# EAGLE design TU56 (EAGLE 6.6.0)
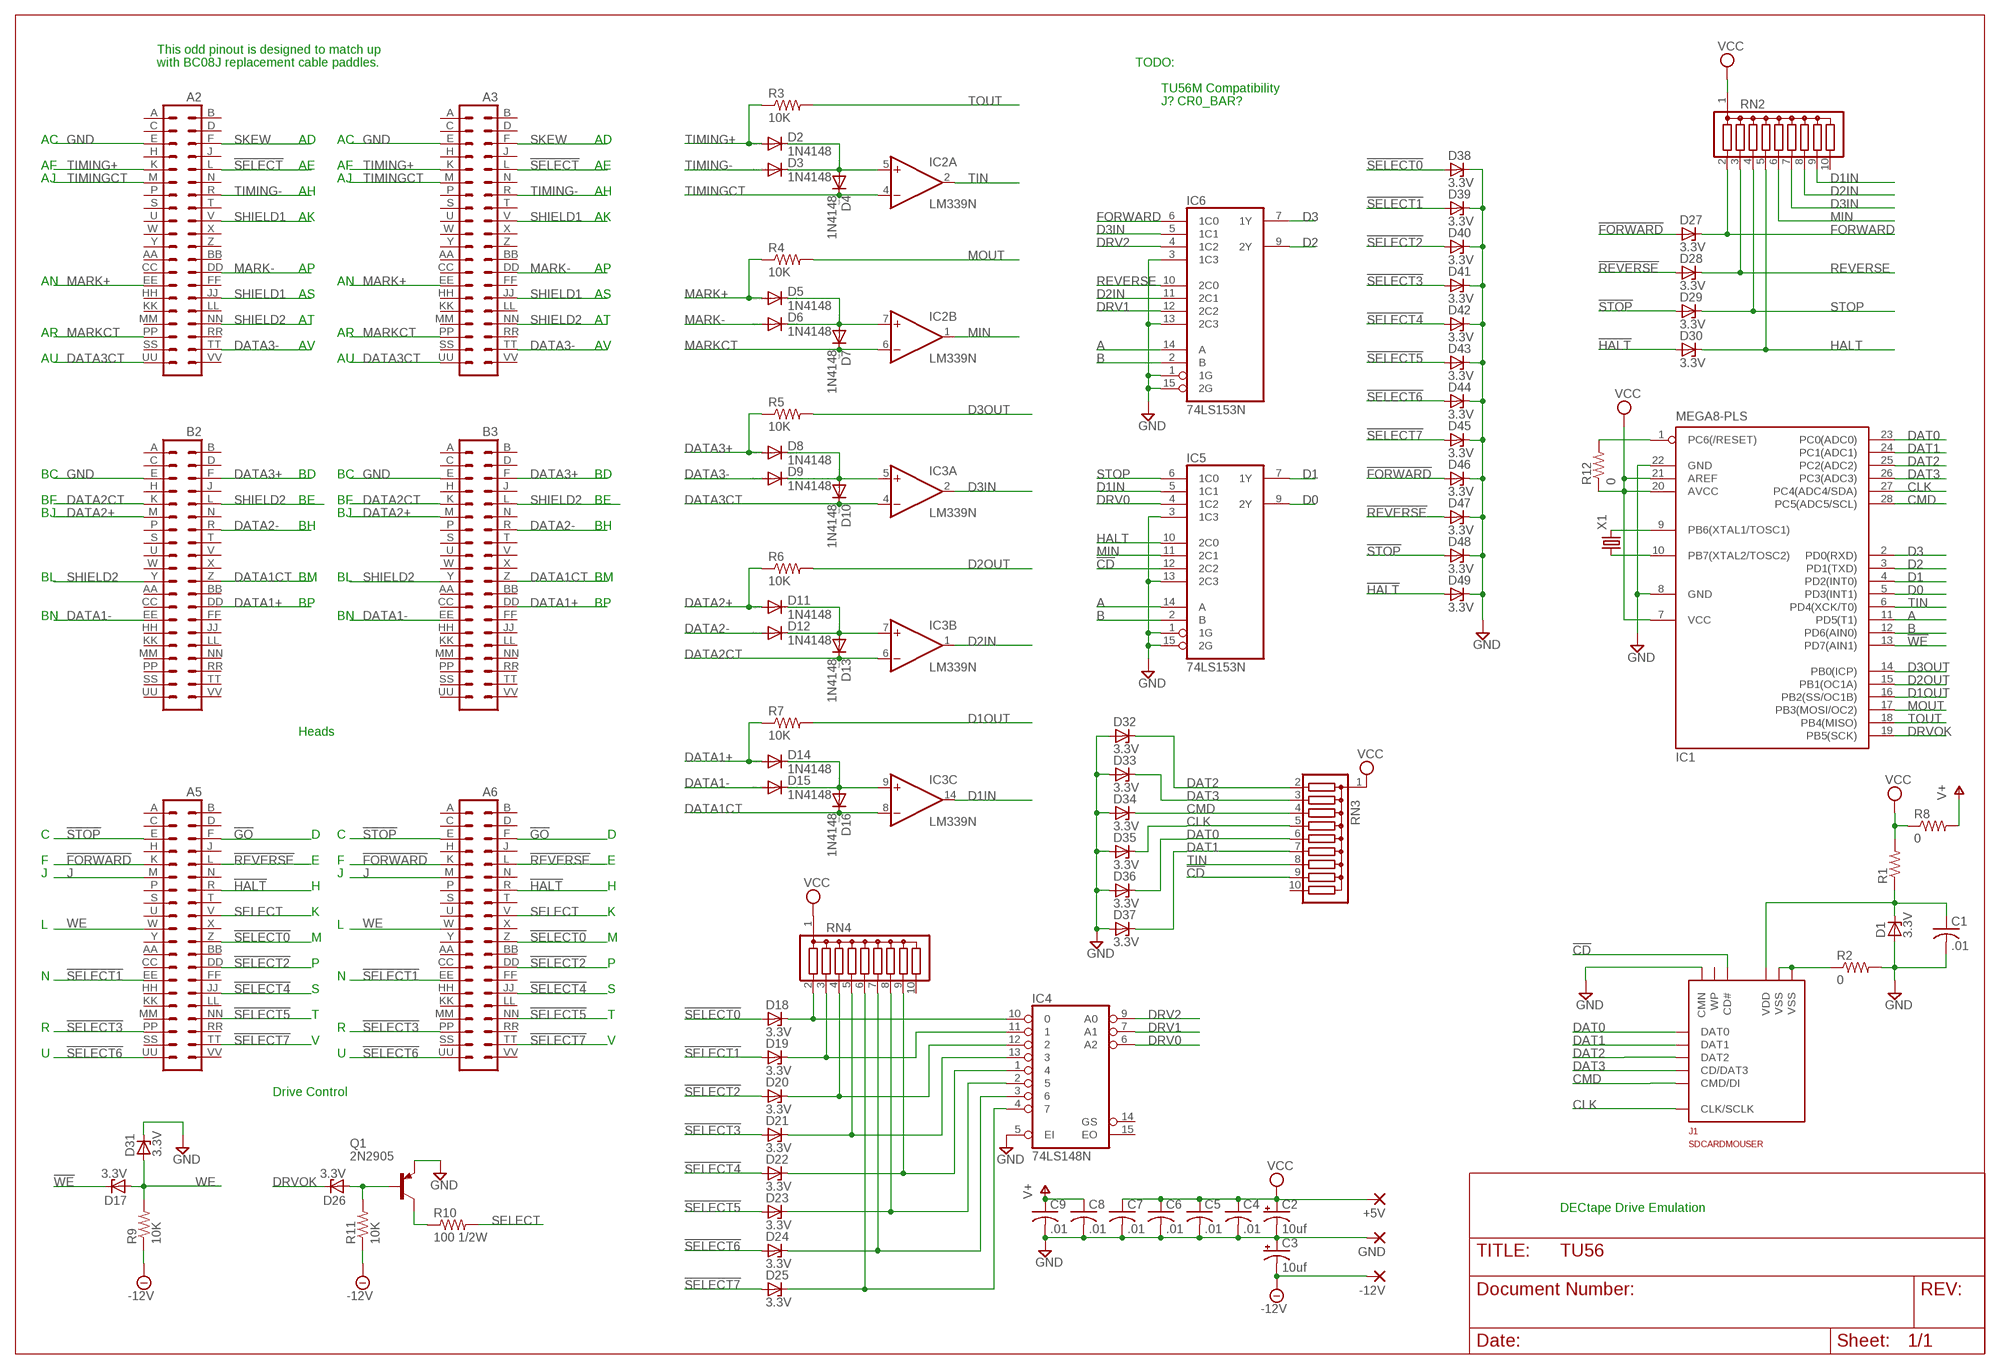
[diagram p0: schematic, sheet 1]

## Parts
+5V  2,15/1,0  [2,15/1,0]
-12V  2,15/1,0  [2,15/1,0]
A2  DEC40PINV  [DEC40PINV]
A3  DEC40PINV  [DEC40PINV]
A5  DEC40PINV  [DEC40PINV]
A6  DEC40PINV  [DEC40PINV]
B2  DEC40PINV  [DEC40PINV]
B3  DEC40PINV  [DEC40PINV]
C1  .01  C-US050-025X075  [C050-025X075]
C2  10uf  CPOL-USE2.5-7  [E2,5-7]
C3  10uf  CPOL-USE2.5-7  [E2,5-7]
C4  .01  C-US050-025X075  [C050-025X075]
C5  .01  C-US050-025X075  [C050-025X075]
C6  .01  C-US050-025X075  [C050-025X075]
C7  .01  C-US050-025X075  [C050-025X075]
C8  .01  C-US050-025X075  [C050-025X075]
C9  .01  C-US050-025X075  [C050-025X075]
D1  3.3V  ZENER-DIODEDO35Z10  [DO35Z10]
D2  1N4148  1N4148DO35-10  [DO35-10]
D3  1N4148  1N4148DO35-10  [DO35-10]
D4  1N4148  1N4148DO35-10  [DO35-10]
D5  1N4148  1N4148DO35-10  [DO35-10]
D6  1N4148  1N4148DO35-10  [DO35-10]
D7  1N4148  1N4148DO35-10  [DO35-10]
D8  1N4148  1N4148DO35-10  [DO35-10]
D9  1N4148  1N4148DO35-10  [DO35-10]
D10  1N4148  1N4148DO35-10  [DO35-10]
D11  1N4148  1N4148DO35-10  [DO35-10]
D12  1N4148  1N4148DO35-10  [DO35-10]
D13  1N4148  1N4148DO35-10  [DO35-10]
D14  1N4148  1N4148DO35-10  [DO35-10]
D15  1N4148  1N4148DO35-10  [DO35-10]
D16  1N4148  1N4148DO35-10  [DO35-10]
D17  3.3V  ZENER-DIODEDO35Z10  [DO35Z10]
D18  3.3V  ZENER-DIODEDO35Z10  [DO35Z10]
D19  3.3V  ZENER-DIODEDO35Z10  [DO35Z10]
D20  3.3V  ZENER-DIODEDO35Z10  [DO35Z10]
D21  3.3V  ZENER-DIODEDO35Z10  [DO35Z10]
D22  3.3V  ZENER-DIODEDO35Z10  [DO35Z10]
D23  3.3V  ZENER-DIODEDO35Z10  [DO35Z10]
D24  3.3V  ZENER-DIODEDO35Z10  [DO35Z10]
D25  3.3V  ZENER-DIODEDO35Z10  [DO35Z10]
D26  3.3V  ZENER-DIODEDO35Z10  [DO35Z10]
D27  3.3V  ZENER-DIODEDO35Z10  [DO35Z10]
D28  3.3V  ZENER-DIODEDO35Z10  [DO35Z10]
D29  3.3V  ZENER-DIODEDO35Z10  [DO35Z10]
D30  3.3V  ZENER-DIODEDO35Z10  [DO35Z10]
D31  3.3V  ZENER-DIODEDO35Z10  [DO35Z10]
D32  3.3V  ZENER-DIODEDO35Z10  [DO35Z10]
D33  3.3V  ZENER-DIODEDO35Z10  [DO35Z10]
D34  3.3V  ZENER-DIODEDO35Z10  [DO35Z10]
D35  3.3V  ZENER-DIODEDO35Z10  [DO35Z10]
D36  3.3V  ZENER-DIODEDO35Z10  [DO35Z10]
D37  3.3V  ZENER-DIODEDO35Z10  [DO35Z10]
D38  3.3V  ZENER-DIODEDO35Z10  [DO35Z10]
D39  3.3V  ZENER-DIODEDO35Z10  [DO35Z10]
D40  3.3V  ZENER-DIODEDO35Z10  [DO35Z10]
D41  3.3V  ZENER-DIODEDO35Z10  [DO35Z10]
D42  3.3V  ZENER-DIODEDO35Z10  [DO35Z10]
D43  3.3V  ZENER-DIODEDO35Z10  [DO35Z10]
D44  3.3V  ZENER-DIODEDO35Z10  [DO35Z10]
D45  3.3V  ZENER-DIODEDO35Z10  [DO35Z10]
D46  3.3V  ZENER-DIODEDO35Z10  [DO35Z10]
D47  3.3V  ZENER-DIODEDO35Z10  [DO35Z10]
D48  3.3V  ZENER-DIODEDO35Z10  [DO35Z10]
D49  3.3V  ZENER-DIODEDO35Z10  [DO35Z10]
GND  2,15/1,0  [2,15/1,0]
IC1  MEGA8-PLS  [DIL28-3]
IC2  LM339N  [DIL14]
IC3  LM339N  [DIL14]
IC4  74LS148N  [DIL16]
IC5  74LS153N  [DIL16]
IC6  74LS153N  [DIL16]
J1  SDCARDMOUSER  [SCDA1A]
Q1  2N2905  [TO5]
R1  R-US_0207/10  [0207/10]
R2  0  R-US_0207/10  [0207/10]
R3  10K  R-US_0207/10  [0207/10]
R4  10K  R-US_0207/10  [0207/10]
R5  10K  R-US_0207/10  [0207/10]
R6  10K  R-US_0207/10  [0207/10]
R7  10K  R-US_0207/10  [0207/10]
R8  0  R-US_0207/10  [0207/10]
R9  10K  R-US_0207/10  [0207/10]
R10  100 1/2W  R-US_0309/V  [0309V]
R11  10K  R-US_0207/10  [0207/10]
R12  0  R-US_0207/10  [0207/10]
RN2  G09R  [SIL10]
RN3  G09R  [SIL10]
RN4  G09R  [SIL10]
X1  CRYSTALHC49S  [HC49/S]

## Nets
!CD: IC5.12(2C2) J1.10(CD#) RN3.9
!FORWARD: A5.K A6.K D27.A D46.A
!GO: A5.F A6.F
!HALT: A5.R A6.R D30.A D49.A
!REVERSE: A5.L A6.L D28.A D47.A
!SELECT: A2.L A3.L
!SELECT0: A5.Z A6.Z D18.A D38.A
!SELECT1: A5.EE A6.EE D19.A D39.A
!SELECT2: A5.DD A6.DD D20.A D40.A
!SELECT3: A5.PP A6.PP D21.A D41.A
!SELECT4: A5.JJ A6.JJ D22.A D42.A
!SELECT5: A5.NN A6.NN D23.A D43.A
!SELECT6: A5.UU A6.UU D24.A D44.A
!SELECT7: A5.TT A6.TT D25.A D45.A
!STOP: A5.E A6.E D29.A D48.A
!WE: D17.C IC1.13(PD7(AIN1))
-12V [Supply]: -12V.1(P) C3.- R9.1 R11.1
A: IC1.11(PD5(T1)) IC5.14(A) IC6.14(A)
B: IC1.12(PD6(AIN0)) IC5.2(B) IC6.2(B)
CLK: D35.C IC1.27(PC4(ADC4/SDA)) J1.5(CLK/SCLK) RN3.5
CMD: D34.C IC1.28(PC5(ADC5/SCL)) J1.2(CMD/DI) RN3.4
D0: IC1.5(PD3(INT1)) IC5.9(2Y)
D1: IC1.4(PD2(INT0)) IC5.7(1Y)
D1IN: IC3.14(C:OUT) IC5.5(1C1) RN2.9
D1OUT: IC1.16(PB2(SS/OC1B)) R7.2
D2: IC1.3(PD1(TXD)) IC6.9(2Y)
D2IN: IC3.1(B:OUT) IC6.11(2C1) RN2.8
D2OUT: IC1.15(PB1(OC1A)) R6.2
D3: IC1.2(PD0(RXD)) IC6.7(1Y)
D3IN: IC3.2(A:OUT) IC6.5(1C1) RN2.7
D3OUT: IC1.14(PB0(ICP)) R5.2
DAT0: D36.C IC1.23(PC0(ADC0)) J1.7(DAT0) RN3.6
DAT1: D37.C IC1.24(PC1(ADC1)) J1.8(DAT1) RN3.7
DAT2: D32.C IC1.25(PC2(ADC2)) J1.9(DAT2) RN3.2
DAT3: D33.C IC1.26(PC3(ADC3)) J1.1(CD/DAT3) RN3.3
DATA1+: B2.DD B3.DD D14.A R7.1
DATA1-: B2.EE B3.EE D15.A
DATA1CT: B2.Z B3.Z D16.C IC3.8(C:-IN)
DATA2+: B2.M B3.M D11.A R6.1
DATA2-: B2.R B3.R D12.A
DATA2CT: B2.K B3.K D13.C IC3.6(B:-IN)
DATA3+: B2.F B3.F D8.A R5.1
DATA3-: A2.TT A3.TT D9.A
DATA3CT: A2.UU A3.UU D10.C IC3.4(A:-IN)
DRV0: IC4.6(A2) IC5.4(1C2)
DRV1: IC4.7(A1) IC6.12(2C2)
DRV2: IC4.9(A0) IC6.4(1C2)
DRVOK: D26.C IC1.19(PB5(SCK))
FORWARD: D27.C IC6.6(1C0) RN2.2
GND [Supply]: A2.E A3.E B2.E B3.E C1.2 C2.- C3.+ C4.2 C5.2 C6.2 C7.2 C8.2 C9.2 D1.A D31.C D32.A D33.A D34.A D35.A D36.A D37.A D38.C D39.C D40.C D41.C D42.C D43.C D44.C D45.C D46.C D47.C D48.C D49.C GND.1(P) IC1.8(GND) IC1.22(GND) IC4.5(EI) IC5.1(1G) IC5.3(1C3) IC5.13(2C3) IC5.15(2G) IC6.1(1G) IC6.3(1C3) IC6.13(2C3) IC6.15(2G) J1.11(CMN) Q1.1(E) R2.2
HALT: D30.C IC5.10(2C0) RN2.5
J: A5.M A6.M
MARK+: A2.EE A3.EE D5.A R4.1
MARK-: A2.DD A3.DD D6.A
MARKCT: A2.PP A3.PP D7.C IC2.6(B:-IN)
MIN: IC2.1(B:OUT) IC5.11(2C1) RN2.6
MOUT: IC1.17(PB3(MOSI/OC2)) R4.2
N$1: IC1.10(PB7(XTAL2/TOSC2)) X1.1
N$2: IC1.9(PB6(XTAL1/TOSC1)) X1.2
N$3: D18.C IC4.10 RN4.2
N$4: D19.C IC4.11 RN4.3
N$5: D20.C IC4.12 RN4.4
N$7: D2.C D3.C D4.A IC2.5(A:+IN)
N$8: D21.C IC4.13 RN4.5
N$9: D22.C IC4.1 RN4.9
N$10: D23.C IC4.2 RN4.8
N$11: D5.C D6.C D7.A IC2.7(B:+IN)
N$12: D8.C D9.C D10.A IC3.5(A:+IN)
N$13: D11.C D12.C D13.A IC3.7(B:+IN)
N$14: D14.C D15.C D16.A IC3.9(C:+IN)
N$15: D24.C IC4.3 RN4.7
N$16: D25.C IC4.4 RN4.6
N$17: IC1.1(PC6(/RESET)) R12.2
N$18: Q1.3(C) R10.1
N$19: D26.A Q1.2(B) R11.2
REVERSE: D28.C IC6.10(2C0) RN2.3
SELECT: A5.V A6.V R10.2
SHIELD1 [Supply]: A2.JJ A2.V A3.JJ A3.V
SHIELD2 [Supply]: A2.NN A3.NN B2.L B2.Y B3.L B3.Y
SKEW: A2.F A3.F
STOP: D29.C IC5.6(1C0) RN2.4
TIMING+: A2.K A3.K D2.A R3.1
TIMING-: A2.R A3.R D3.A
TIMINGCT: A2.M A3.M D4.C IC2.4(A:-IN)
TIN: IC1.6(PD4(XCK/T0)) IC2.2(A:OUT) RN3.8
TOUT: IC1.18(PB4(MISO)) R3.2
V+ [Supply]: C8.1 C9.1 R8.2
VCC [Supply]: +5V.1(P) C2.+ C4.1 C5.1 C6.1 C7.1 IC1.7(VCC) IC1.20(AVCC) IC1.21(AREF) R1.2 R8.1 R12.1 RN2.1 RN3.1 RN4.1
VDD [Supply]: C1.1 D1.C J1.4(VDD) R1.1
VSS [Supply]: J1.3(VSS) J1.6(VSS) R2.1
WE: A5.W A6.W D17.A D31.A R9.2
Unconnected: A2.A A2.AA A2.B A2.BB A2.C A2.CC A2.D A2.FF A2.H A2.HH A2.J A2.KK A2.LL A2.MM A2.N A2.P A2.RR A2.S A2.SS A2.T A2.U A2.VV A2.W A2.X A2.Y A2.Z A3.A A3.AA A3.B A3.BB A3.C A3.CC A3.D A3.FF A3.H A3.HH A3.J A3.KK A3.LL A3.MM A3.N A3.P A3.RR A3.S A3.SS A3.T A3.U A3.VV A3.W A3.X A3.Y A3.Z A5.A A5.AA A5.B A5.BB A5.C A5.CC A5.D A5.FF A5.H A5.HH A5.J A5.KK A5.LL A5.MM A5.N A5.P A5.RR A5.S A5.SS A5.T A5.U A5.VV A5.X A5.Y A6.A A6.AA A6.B A6.BB A6.C A6.CC A6.D A6.FF A6.H A6.HH A6.J A6.KK A6.LL A6.MM A6.N A6.P A6.RR A6.S A6.SS A6.T A6.U A6.VV A6.X A6.Y B2.A B2.AA B2.B B2.BB B2.C B2.CC B2.D B2.FF B2.H B2.HH B2.J B2.JJ B2.KK B2.LL B2.MM B2.N B2.NN B2.P B2.PP B2.RR B2.S B2.SS B2.T B2.TT B2.U B2.UU B2.V B2.VV B2.W B2.X B3.A B3.AA B3.B B3.BB B3.C B3.CC B3.D B3.FF B3.H B3.HH B3.J B3.JJ B3.KK B3.LL B3.MM B3.N B3.NN B3.P B3.PP B3.RR B3.S B3.SS B3.T B3.TT B3.U B3.UU B3.V B3.VV B3.W B3.X IC2.8(C:-IN) IC2.9(C:+IN) IC2.10(D:-IN) IC2.11(D:+IN) IC2.13(D:OUT) IC2.14(C:OUT) IC3.10(D:-IN) IC3.11(D:+IN) IC3.13(D:OUT) IC4.14(GS) IC4.15(EO) J1.12(WP) RN2.10 RN3.10 RN4.10

## Notes on the sheet
- This odd pinout is designed to match up
- with BC08J replacement cable paddles. | TODO:
- TU56M Compatibility
- J? CR0_BAR?
- AC | AD | AC | AD
- AF | AE | AF | AE
- AJ | AJ
- AH | AH
- AK | AK
- AP | AP
- AN | AN
- AS | AS
- AT | AT
- AR | AR
- AV | AV
- AU | AU
- BC | BD | BC | BD
- BF | BE | BF | BE
- BJ | BJ
- BH | BH
- BL | BM | BL | BM
- BP | BP
- BN | BN
- Heads
- C | D | C | D
- F | E | F | E
- J | J
- H | H
- K | K
- L | L
- M | M
- P | P
- N | N
- S | S
- T | T
- R | R
- V | V
- U | U
- Drive Control
- DECtape Drive Emulation

## Power pins joined to a net without a drawn wire
GND: IC2.12(P:GND) IC3.12(P:GND) IC4.8(GND) IC5.8(GND) IC6.8(GND) J1.13(GND) J1.14(GND)
V+: IC2.3(P:V+) IC3.3(P:V+)
VCC: IC4.16(VCC) IC5.16(VCC) IC6.16(VCC)

## Library data of the parts
+5V -12V GND = wirepad:2,15/1,0: THROUGH-HOLE PAD
A2 A3 A5 A6 B2 B3 = dec-con:DEC40PIN: PIN HEADER
C1 C4-C9 = rcl:C-US: CAPACITOR, American symbol
C2 C3 = rcl:CPOL-US: POLARIZED CAPACITOR, American symbol
D1 D17-D49 = diode:ZENER-DIODE: Z-Diode
D2-D16 = diode:1N4148: DIODE high speed (Philips)
IC1 = atmel:MEGA8-P: MICROCONTROLLER 8 Kbytes FLASH, 1 kbytes SRAM, 512 bytes EEPROM, USART, 4-channel 10 bit ADC, 2-channel 8 bit ADC Pin compatible with Atmega48, ATMega88, ATMega168 Source: avr.lbr
IC2 IC3 = linear:LM339: Low Power Low Offset Voltage Quad Comparators with open collector; LM139/LM239/LM339/LM2901/LM3302
IC4 = 74xx-us:74*148: 10-line to 4-line and 8-line to 3-line PRIORITY ENCODER
IC5 IC6 = 74xx-us:74*153: Dual 4-line to 1-line data SELECTOR/MULTIPLEXER
J1 = sdcards:SDCARD: SD Card Holder
Q1 = transistor-pnp:2N2905: PNP Transistor
R1-R12 = rcl:R-US_: RESISTOR, American symbol
RN2-RN4 = resistor-sil:G09R: SIL RESISTOR; OC_FARNELL: unknown; OC_NEWARK: unknown
X1 = crystal:CRYSTAL: CRYSTAL; OC_FARNELL: 1667008; OC_NEWARK: unknown

## Net classes
1 Supply: width 0.508 mm, clearance 0.381 mm

## Board
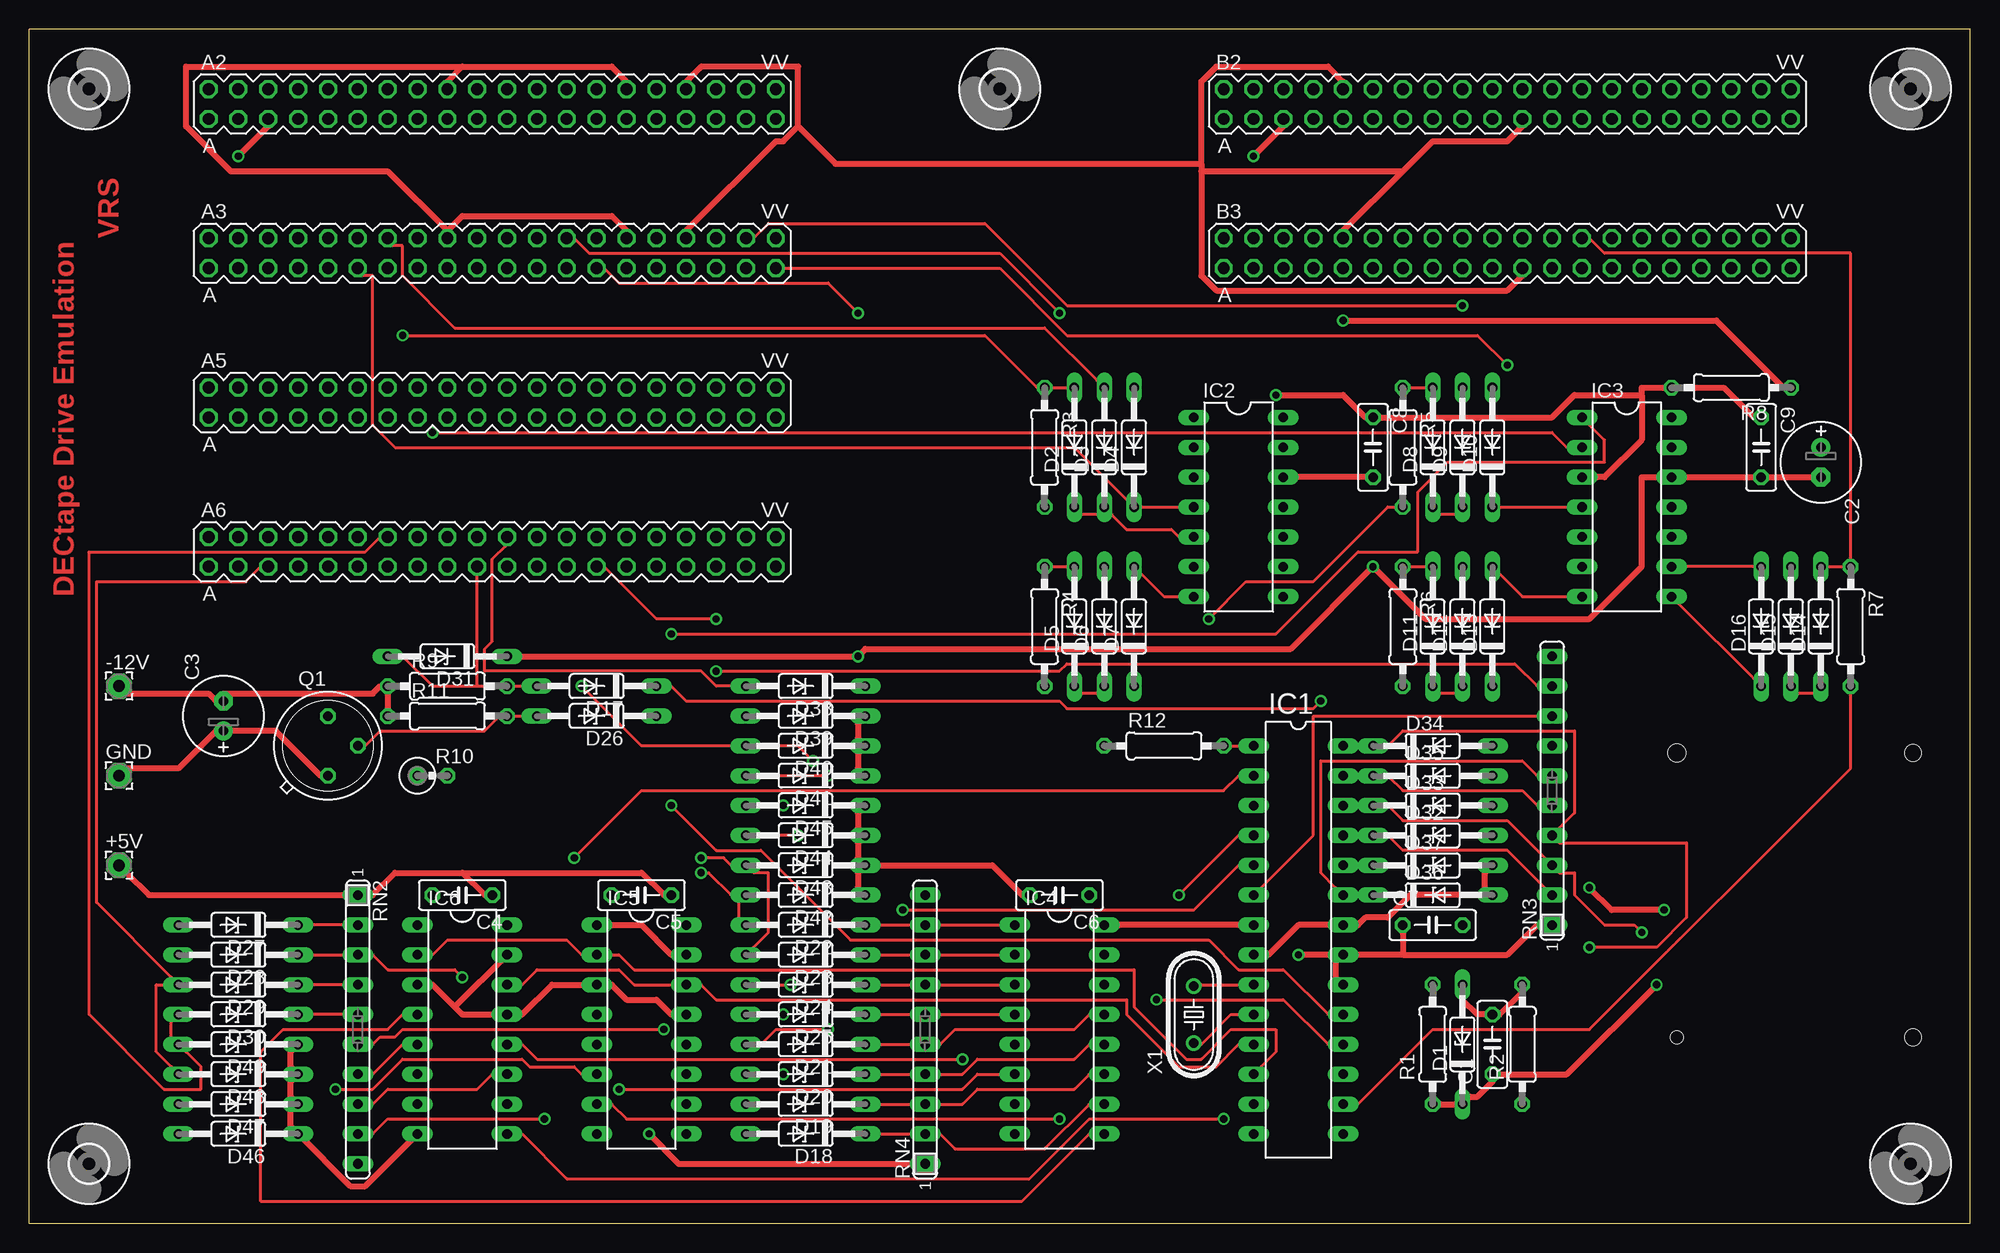
[diagram p1: board, top side]
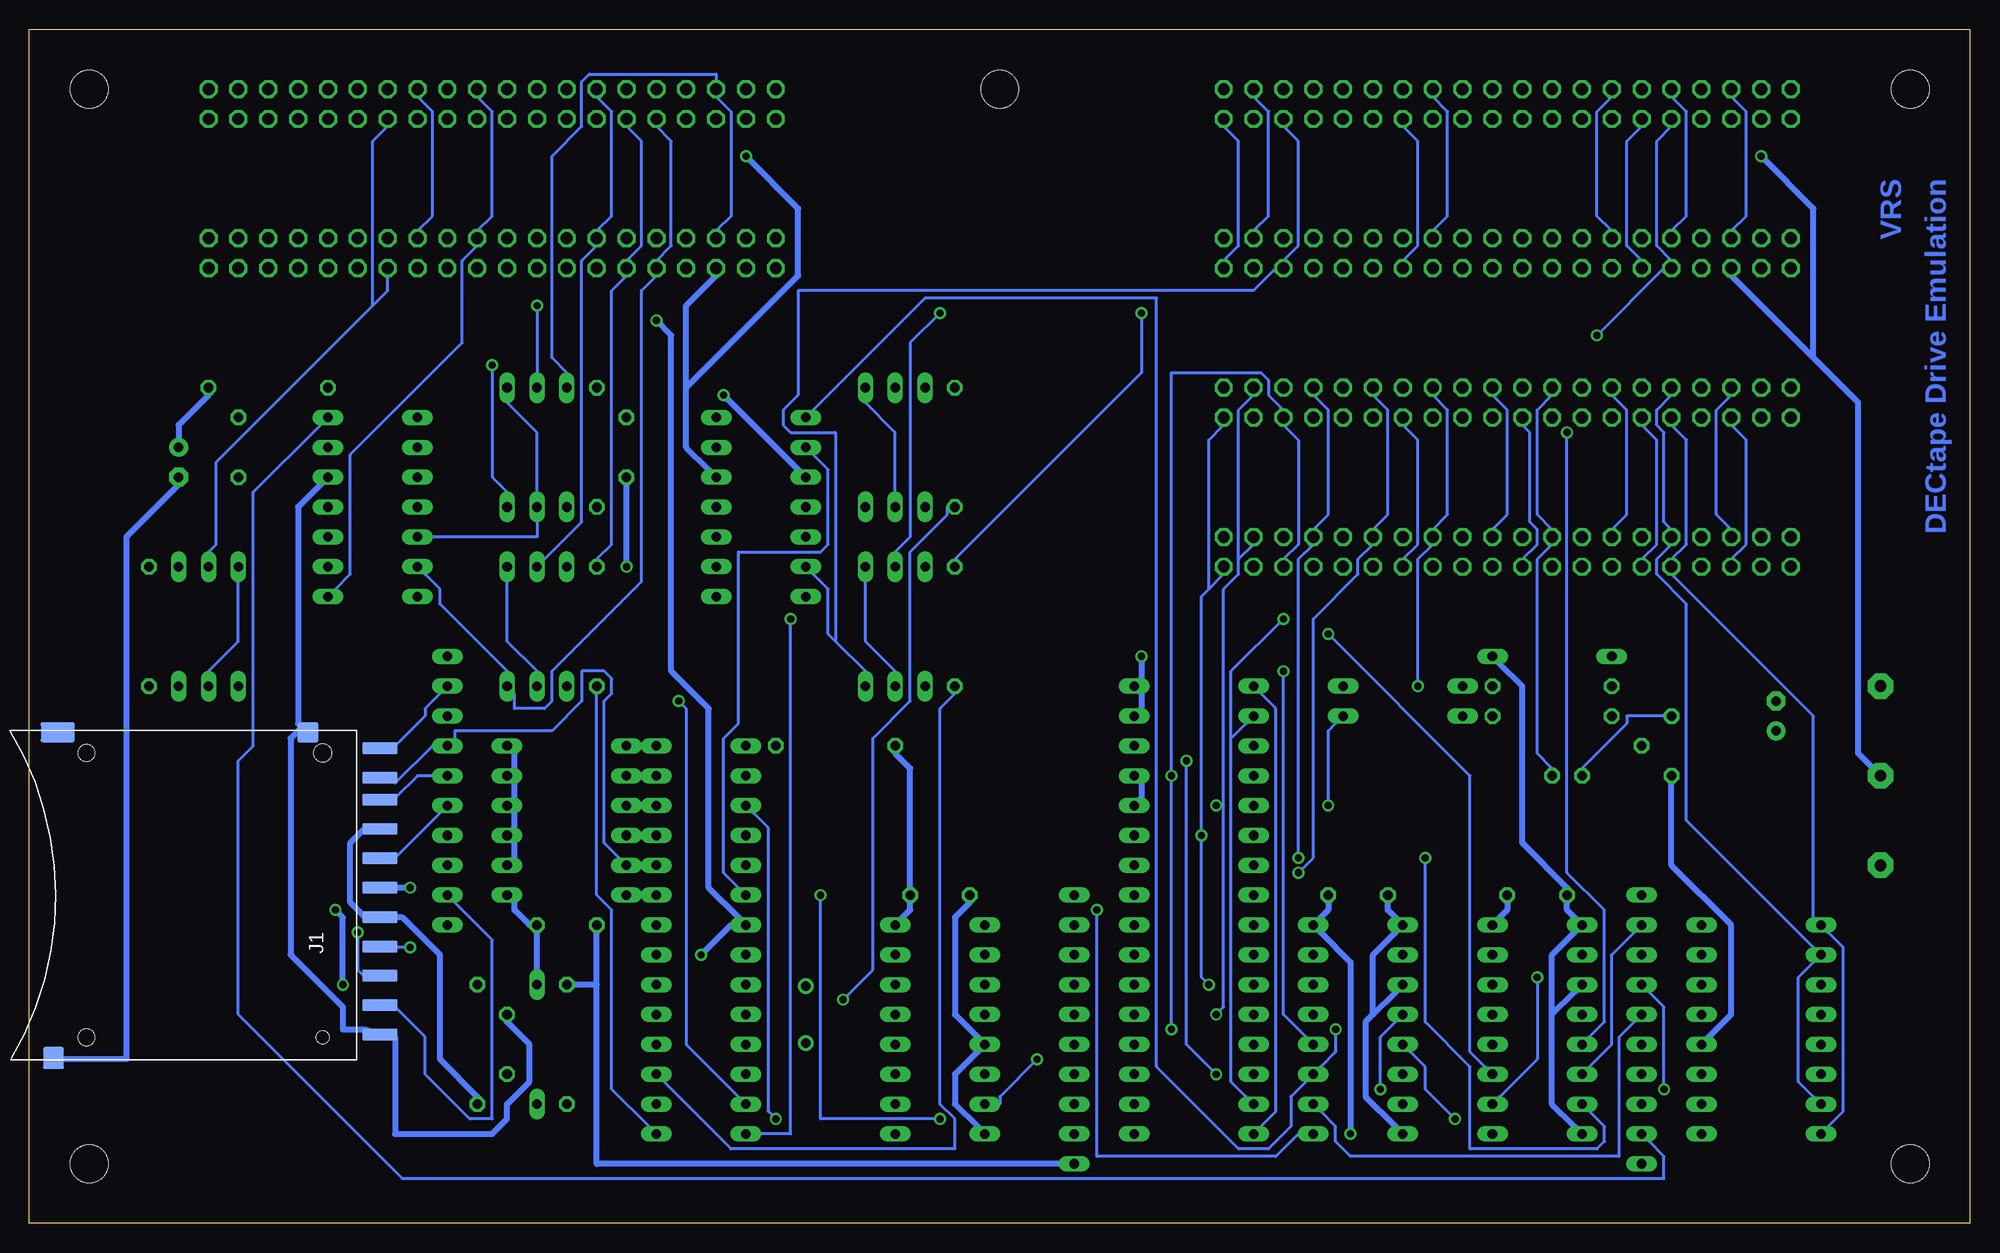
[diagram p2: board, bottom side, seen from below]

Size 165.1 x 101.6 mm. Coordinates in mm from the lower left corner, seen from the top.
Outline: 0,0 165.1,0 165.1,101.6 0,101.6 0,0
Copper layers (1*16): Top 0.035mm / dielectric 1.5mm / Bottom 0.035mm
Design rules "custompcb": minimum track width 10mil, minimum drill 24mil, track to track 8mil, track to pad 8mil, pad to pad 8mil, via to via 8mil, smd to smd 0mil, copper to edge 10mil, drill to drill 8mil, minimum pad ring 10mil, minimum via ring 8mil, stop-mask expansion 4mil, vias tented up to drill 0mil, thermal gap 10mil

### Footprints (pad centres in the part's own frame; a part is rotated, then mirrored left to right if it is on the bottom)
2,15/1,0 = drill 1.016 pad 2.159 octagon: 1 0,0
DEC40PINV = drill 1.016 octagon: A -24.13,-1.27; AA 3.81,-1.27; B -24.13,1.27; BB 3.81,1.27; C -21.59,-1.27; CC 6.35,-1.27; D -21.59,1.27; DD 6.35,1.27; E -19.05,-1.27; EE 8.89,-1.27; F -19.05,1.27; FF 8.89,1.27; H -16.51,-1.27; HH 11.43,-1.27; J -16.51,1.27; JJ 11.43,1.27; K -13.97,-1.27; KK 13.97,-1.27; L -13.97,1.27; LL 13.97,1.27; M -11.43,-1.27; MM 16.51,-1.27; N -11.43,1.27; NN 16.51,1.27; P -8.89,-1.27; PP 19.05,-1.27; R -8.89,1.27; RR 19.05,1.27; S -6.35,-1.27; SS 21.59,-1.27; T -6.35,1.27; TT 21.59,1.27; U -3.81,-1.27; UU 24.13,-1.27; V -3.81,1.27; VV 24.13,1.27; W -1.27,-1.27; X -1.27,1.27; Y 1.27,-1.27; Z 1.27,1.27
C050-025X075 = drill 0.813 octagon: 1 -2.54,0; 2 2.54,0
E2,5-7 = drill 0.813 pad 1.6: + -1.27,0 | drill 0.813 pad 1.6 octagon: - 1.27,0
DO35Z10 = drill 0.813 long: A 5.08,0; C -5.08,0
DO35-10 = drill 0.813 long: A 5.08,0; C -5.08,0
DIL28-3 = drill 0.813 long: 1 -16.51,-3.81; 2 -13.97,-3.81; 3 -11.43,-3.81; 4 -8.89,-3.81; 5 -6.35,-3.81; 6 -3.81,-3.81; 7 -1.27,-3.81; 8 1.27,-3.81; 9 3.81,-3.81; 10 6.35,-3.81; 11 8.89,-3.81; 12 11.43,-3.81; 13 13.97,-3.81; 14 16.51,-3.81; 15 16.51,3.81; 16 13.97,3.81; 17 11.43,3.81; 18 8.89,3.81; 19 6.35,3.81; 20 3.81,3.81; 21 1.27,3.81; 22 -1.27,3.81; 23 -3.81,3.81; 24 -6.35,3.81; 25 -8.89,3.81; 26 -11.43,3.81; 27 -13.97,3.81; 28 -16.51,3.81
DIL14 = drill 0.813 long: 1 -7.62,-3.81; 2 -5.08,-3.81; 3 -2.54,-3.81; 4 0,-3.81; 5 2.54,-3.81; 6 5.08,-3.81; 7 7.62,-3.81; 8 7.62,3.81; 9 5.08,3.81; 10 2.54,3.81; 11 0,3.81; 12 -2.54,3.81; 13 -5.08,3.81; 14 -7.62,3.81
DIL16 = drill 0.813 long: 1 -8.89,-3.81; 2 -6.35,-3.81; 3 -3.81,-3.81; 4 -1.27,-3.81; 5 1.27,-3.81; 6 3.81,-3.81; 7 6.35,-3.81; 8 8.89,-3.81; 9 8.89,3.81; 10 6.35,3.81; 11 3.81,3.81; 12 1.27,3.81; 13 -1.27,3.81; 14 -3.81,3.81; 15 -6.35,3.81; 16 -8.89,3.81
SCDA1A = smd 1 x 2.95: 1 -6.865,-10.76; 2 -4.365,-10.76; 3 -1.865,-10.76; 4 0.635,-10.76; 5 3.135,-10.76; 6 5.635,-10.76; 7 8.135,-10.76; 8 10,-10.76; 9 -9.365,-10.76; 10 12.5,-10.76; 13 -11.865,-10.76 | smd 1.7 x 1.8: 11 13.85,-4.65 | smd 1.7 x 2.9: 12 13.85,16.65 | smd 1.9 x 1.8: 14 -13.85,17 | hole 1.05: -12.1,-5.9 | hole 1.5: 12.1,-5.9 | hole 1.4: 12.1,14.2; -12.1,14.2
TO5 = drill 0.813 octagon: 1 0,-2.54; 2 2.54,0; 3 0,2.54
0207/10 = drill 0.813 octagon: 1 -5.08,0; 2 5.08,0
0309V = drill 0.813 octagon: 1 -1.27,0; 2 1.27,0
SIL10 = drill 0.813 long: 1 -11.43,0; 2 -8.89,0; 3 -6.35,0; 4 -3.81,0; 5 -1.27,0; 6 1.27,0; 7 3.81,0; 8 6.35,0; 9 8.89,0; 10 11.43,0
3,2 = hole 3.2: 0,0
HC49/S = drill 0.813: 1 -2.413,0; 2 2.413,0

### Placement (x,y rotation side)
+5V  7.62,30.48 0 top
-12V  7.62,45.72 0 top
A2  39.37,95.25 0 top
A3  39.37,82.55 0 top
A5  39.37,69.85 0 top
A6  39.37,57.15 0 top
B2  125.73,95.25 0 top
B3  125.73,82.55 0 top
C1  124.46,15.24 90 top
C2  152.4,64.77 270 top
C3  16.51,43.18 90 top
C4  36.83,27.94 180 top
C5  52.07,27.94 180 top
C6  87.63,27.94 180 top
C7  119.38,25.4 0 top
C8  114.3,66.04 270 top
C9  147.32,66.04 270 top
D1  121.92,15.24 90 top
D2  88.9,66.04 90 top
D3  91.44,66.04 90 top
D4  93.98,66.04 90 top
D5  88.9,50.8 90 top
D6  91.44,50.8 90 top
D7  93.98,50.8 90 top
D8  119.38,66.04 90 top
D9  121.92,66.04 90 top
D10  124.46,66.04 90 top
D11  119.38,50.8 90 top
D12  121.92,50.8 90 top
D13  124.46,50.8 90 top
D14  152.4,50.8 90 top
D15  149.86,50.8 90 top
D16  147.32,50.8 90 top
D17  48.26,45.72 180 top
D18  66.04,7.62 180 top
D19  66.04,10.16 180 top
D20  66.04,12.7 180 top
D21  66.04,15.24 180 top
D22  66.04,25.4 180 top
D23  66.04,22.86 180 top
D24  66.04,20.32 180 top
D25  66.04,17.78 180 top
D26  48.26,43.18 180 top
D27  17.78,25.4 180 top
D28  17.78,22.86 180 top
D29  17.78,20.32 180 top
D30  17.78,17.78 180 top
D31  35.56,48.26 180 top
D32  119.38,33.02 0 top
D33  119.38,35.56 0 top
D34  119.38,40.64 0 top
D35  119.38,38.1 0 top
D36  119.38,27.94 0 top
D37  119.38,30.48 0 top
D38  66.04,45.72 180 top
D39  66.04,43.18 180 top
D40  66.04,40.64 180 top
D41  66.04,38.1 180 top
D42  66.04,27.94 180 top
D43  66.04,30.48 180 top
D44  66.04,33.02 180 top
D45  66.04,35.56 180 top
D46  17.78,7.62 180 top
D47  17.78,10.16 180 top
D48  17.78,12.7 180 top
D49  17.78,15.24 180 top
GND  7.62,38.1 0 top
IC1  107.95,24.13 270 top
IC2  102.87,60.96 270 top
IC3  135.89,60.96 270 top
IC4  87.63,16.51 270 top
IC5  52.07,16.51 270 top
IC6  36.83,16.51 270 top
J1  146.05,27.94 90 bottom
Q1  25.4,40.64 0 top
R1  119.38,15.24 90 top
R2  127,15.24 90 top
R3  86.36,66.04 270 top
R4  86.36,50.8 270 top
R5  116.84,66.04 270 top
R6  116.84,50.8 270 top
R7  154.94,50.8 270 top
R8  144.78,71.12 180 top
R9  35.56,45.72 0 top
R10  34.29,38.1 0 top
R11  35.56,43.18 0 top
R12  96.52,40.64 0 top
RN2  27.94,16.51 270 top
RN3  129.54,36.83 90 top
RN4  76.2,16.51 90 top
U$1  [3,2]  5.08,5.08 0 top
U$2  [3,2]  5.08,96.52 0 top
U$3  [3,2]  160.02,96.52 0 top
U$4  [3,2]  160.02,5.08 0 top
U$5  [3,2]  82.55,96.52 0 top
X1  99.06,17.78 90 top

### Tracks (layer width: path | path; a pad name or v marks a point on that pad's centre or on a via)
!CD  (via drill 0.61)
  Top 0.254: v58.42,46.99 87.63,46.99 88.27,47.62 126.36,47.62 128.27,45.72 RN3.9
  Bottom 0.254: v58.42,46.99 58.42,17.78 56.52,15.88 IC5.12 | J1.10 133.99,40.64 131.44,43.18 131.44,43.81 130.18,45.09 RN3.9
!FORWARD
  Bottom 0.254: A5.K 25.4,67.94 24.13,66.67 24.13,57.78 25.4,56.52 A6.K 25.4,55.24 13.34,43.18 13.34,26.04 D27.A 12.06,24.77 10.79,23.5 10.79,9.53 12.06,8.26 D46.A
!GO
  Bottom 0.254: A6.F 20.32,59.05 21.59,60.33 21.59,69.22 20.32,70.48 A5.F
!HALT
  Top 0.254: D30.A 12.06,17.14 12.06,15.88 D49.A 13.34,14.61 14.61,13.34 14.61,11.43 11.43,11.43 5.08,17.78 5.08,57.15 28.57,57.15 29.84,58.42 A6.R
  Bottom 0.254: A6.R 30.48,59.05 29.21,60.33 29.21,69.22 30.48,70.48 A5.R
!REVERSE
  Bottom 0.254: D47.A 13.34,10.79 14.61,12.06 14.61,20.95 13.34,22.23 D28.A 13.34,23.5 24.13,34.29 24.13,52.7 26.67,55.24 26.67,56.52 25.4,57.78 A6.L 25.4,59.05 26.04,59.69 26.04,67.31 26.67,67.94 26.67,69.22 25.4,70.48 A5.L
!SELECT
  Bottom 0.254: A3.L 25.4,84.45 24.13,85.72 24.13,94.61 25.4,95.89 A2.L
!SELECT0
  Top 0.254: A6.Z 40.64,57.78 39.37,56.52 39.37,49.53 38.73,48.9 38.73,46.99 57.15,46.99 58.42,45.72 59.69,45.72 D38.A
  Bottom 0.254: A6.Z 40.64,59.05 39.37,60.33 39.37,69.22 40.64,70.48 A5.Z | D18.A 60.33,8.26 59.05,9.53 59.05,43.81 60.33,45.09 D38.A
!SELECT1  (via drill 0.61)
  Top 0.254: v58.42,51.44 53.34,51.44 48.9,55.88 A6.EE
  Bottom 0.254: A6.EE 48.26,56.52 46.99,57.78 46.99,66.67 48.26,67.94 A5.EE | 62.87,41.27 62.87,12.06 61.59,10.79 D19.A | 62.87,41.27 61.59,42.55 D39.A | v58.42,51.44 62.87,46.99 62.87,41.27
!SELECT2  (via drill 0.61)
  Top 0.254: v64.14,12.7 62.23,12.7 D20.A | v66.67,39.37 65.41,40.64 62.23,40.64 D40.A 59.69,40.64 52.07,40.64 v46.99,45.72
  Bottom 0.254: A5.DD 45.72,70.48 44.45,69.22 44.45,60.33 45.72,59.05 A6.DD 45.72,57.78 46.99,56.52 v46.99,45.72 | v64.14,12.7 66.67,15.24 v66.67,39.37
!SELECT3  (via drill 0.61)
  Top 0.254: v67.94,16.51 63.5,16.51 62.23,15.24 D21.A | v67.94,38.1 62.23,38.1 D41.A
  Bottom 0.254: A6.PP 58.42,56.52 57.15,57.78 57.15,66.67 58.42,67.94 A5.PP 58.42,69.22 59.69,70.48 59.69,71.75 60.33,72.39 67.94,72.39 v67.94,38.1 v67.94,16.51
!SELECT4  (via drill 0.61)
  Top 0.254: D22.A 60.33,26.04 60.33,27.3 D42.A 59.69,27.94 57.78,29.84 v57.15,29.84
  Bottom 0.254: A5.JJ 50.8,70.48 49.53,69.22 49.53,60.33 50.8,59.05 A6.JJ 50.8,57.78 52.07,56.52 52.07,55.24 55.88,51.44 55.88,31.11 v57.15,29.84
!SELECT5  (via drill 0.61)
  Top 0.254: D23.A 61.59,23.5 62.87,24.77 62.87,29.84 61.59,29.84 D43.A 59.69,30.48 59.05,31.11 v57.15,31.11
  Bottom 0.254: A5.NN 55.88,70.48 54.61,69.22 54.61,60.33 55.88,59.05 A6.NN 55.88,57.78 57.15,56.52 v57.15,31.11
!SELECT6  (via drill 0.61)
  Top 0.254: v64.77,20.32 62.23,20.32 D24.A | v65.41,33.02 62.23,33.02 D44.A
  Bottom 0.254: v64.77,20.32 65.41,20.95 v65.41,33.02 65.41,53.34 64.77,53.98 | 64.77,53.98 63.5,55.24 A6.UU | 64.77,53.98 64.77,66.67 63.5,67.94 A5.UU
!SELECT7  (via drill 0.61)
  Top 0.254: v64.14,17.78 62.23,17.78 D25.A | v64.14,35.56 62.23,35.56 D45.A
  Bottom 0.254: v64.14,17.78 63.5,18.41 63.5,35.56 | 63.5,35.56 63.5,53.98 62.23,55.24 62.23,56.52 | 62.23,56.52 60.96,57.78 A6.TT | 63.5,35.56 v64.14,35.56 | 62.23,56.52 62.23,69.22 60.96,70.48 A5.TT
!STOP
  Top 0.254: D48.A 12.06,13.34 10.79,14.61 10.79,20.32 11.43,20.32 D29.A 12.06,20.95 5.71,27.3 5.71,54.61 18.41,54.61 19.68,55.88 A6.E
  Bottom 0.254: A6.E 20.32,56.52 19.05,57.78 19.05,66.67 20.32,67.94 A5.E
!WE  (via drill 0.61)
  Top 0.254: v109.86,44.45 109.22,43.81 88.27,43.81 87.63,44.45 55.88,44.45 54.61,45.72 D17.C
  Bottom 0.254: v109.86,44.45 109.22,43.81 109.22,15.24 104.78,10.79 IC1.13
-12V
  Top 0.508: R11.1 30.48,43.81 30.48,45.09 R9.1 29.84,45.72 29.21,45.09 16.51,45.09 C3.- 15.88,44.45 15.24,45.09 8.26,45.09 -12V.1
A
  Top 0.254: IC6.14 41.91,20.32 43.18,21.59 50.16,21.59 51.44,20.32 54.61,20.32 IC5.14 57.15,20.32 58.42,19.05 93.34,19.05 93.34,17.78 97.79,13.34 100.97,13.34 102.87,15.24 IC1.11
B
  Top 0.254: IC6.2 34.29,22.86 35.56,24.13 45.72,24.13 46.99,22.86 IC5.2 49.53,22.86 50.16,22.86 51.44,21.59 93.98,21.59 93.98,18.41 98.42,13.97 99.69,13.97 102.23,16.51 106.05,16.51 106.05,14.61 104.78,13.34 IC1.12
CLK
  Top 0.254: IC1.27 113.03,38.1 D35.C 115.57,38.1 116.84,36.83 127,36.83 128.27,35.56 RN3.5
  Bottom 0.254: RN3.5 130.18,34.92 133.99,31.11 J1.5
CMD  (via drill 0.61)
  Top 0.254: IC1.28 113.03,40.64 D34.C 115.57,40.64 116.84,41.91 131.44,41.91 131.44,34.92 130.18,33.66 RN3.4 130.18,32.38 140.97,32.38 140.97,26.04 138.43,23.5 v132.72,23.5
  Bottom 0.254: v132.72,23.5 133.99,23.5 J1.2
D0  (via drill 0.61)
  Top 0.254: v74.3,26.67 99.06,26.67 102.87,30.48 IC1.5
  Bottom 0.254: v74.3,26.67 74.3,5.71 59.05,5.71 57.15,7.62 IC5.9
D1  (via drill 0.61)
  Top 0.254: v87.63,8.89 50.8,8.89 49.53,10.16 IC5.7 | v97.79,27.94 102.87,33.02 IC1.4
  Bottom 0.254: v87.63,8.89 97.79,8.89 v97.79,27.94
D1IN  (via drill 0.61)
  Top 0.254: v43.81,8.89 30.48,8.89 29.21,7.62 RN2.9
  Bottom 0.254: v43.81,8.89 46.35,11.43 46.35,13.34 47.62,14.61 IC5.5 | IC3.14 140.34,67.94 146.05,62.23 146.05,40.64 147.32,39.37 147.32,17.78 133.35,3.81 26.04,3.81 26.04,5.71 27.3,6.99 RN2.9
D1OUT
  Top 0.254: IC1.16 113.03,10.16 119.38,16.51 132.72,16.51 154.94,38.73 154.94,45.09 R7.2
D2  (via drill 0.61)
  Top 0.254: v101.6,8.89 90.17,8.89 85.09,3.81 45.72,3.81 41.91,7.62 IC6.9
  Bottom 0.254: v101.6,8.89 102.23,9.53 102.23,33.66 103.5,34.92 IC1.3
D2IN  (via drill 0.61)
  Top 0.254: RN2.8 29.21,10.16 30.48,11.43 38.1,11.43 39.37,12.7 IC6.11 | v54.61,50.16 106.05,50.16 113.03,57.15 118.11,57.15 118.11,62.23 120.65,64.77 133.99,64.77 133.99,66.67 132.72,67.94 IC3.1
  Bottom 0.254: v54.61,50.16 42.55,38.1 42.55,14.61 41.27,13.34 IC6.11
D2OUT
  Bottom 0.254: IC1.15 112.39,8.26 115.57,11.43 115.57,26.67 116.84,27.94 116.84,45.09 R6.2
D3  (via drill 0.61)
  Top 0.254: v46.35,31.11 52.07,36.83 101.6,36.83 102.87,38.1 IC1.2
  Bottom 0.254: v46.35,31.11 46.35,17.14 42.55,13.34 42.55,6.35 31.75,6.35 31.11,6.99 31.11,8.26 32.38,9.53 IC6.7
D3IN  (via drill 0.61)
  Top 0.254: RN2.7 29.21,12.7 31.75,15.24 IC6.5 | v34.29,67.31 129.54,67.31 130.81,66.04 IC3.2
  Bottom 0.254: v34.29,67.31 34.29,29.84 31.11,26.67 31.11,17.14 32.38,15.88 IC6.5
D3OUT  (via drill 0.61)
  Top 0.254: v100.33,51.44 103.5,54.61 109.22,54.61 115.57,60.96 116.2,60.96 R5.2
  Bottom 0.254: v100.33,51.44 100.33,7.62 102.87,7.62 IC1.14
DAT0
  Top 0.254: D36.C 113.03,27.94 IC1.23 111.12,28.57 109.86,29.84 109.86,39.37 127,39.37 128.27,38.1 RN3.6
  Bottom 0.254: RN3.6 130.81,38.1 132.08,38.1 133.99,36.2 J1.7
DAT1
  Top 0.254: IC1.24 113.03,30.48 D37.C
  Bottom 0.254: J1.8 133.99,37.47 130.81,40.64 RN3.7 128.91,41.27 128.91,41.91 120.65,41.91 118.11,44.45 118.11,46.99 116.2,46.99 115.57,46.35 115.57,45.09 116.2,44.45 116.2,32.38 114.94,31.11 D37.C
DAT2
  Top 0.254: IC1.25 113.03,33.02 D32.C 115.57,33.02 116.84,31.75 125.73,31.75 128.91,28.57 RN3.2
  Bottom 0.254: J1.9 133.99,18.41 131.44,15.88 131.44,12.7 127.64,8.89 125.73,8.89 125.73,24.13 128.91,27.3 RN3.2
DAT3  (via drill 0.61)
  Top 0.254: IC1.26 113.03,35.56 D33.C 115.57,35.56 116.84,34.29 125.73,34.29 128.91,31.11 RN3.3 130.18,29.84 131.44,29.84 131.44,27.94 133.99,25.4 136.53,25.4 v137.16,24.77
  Bottom 0.254: v137.16,24.77 137.16,21.59 136.53,20.95 J1.1
DATA1+
  Top 0.254: D14.A 153.03,55.88 154.31,55.88 R7.1 154.94,56.52 154.94,82.55 133.99,82.55 132.72,83.82 B3.DD
  Bottom 0.254: B3.DD 132.08,84.45 130.81,85.72 130.81,94.61 132.08,95.89 B2.DD
DATA1-
  Bottom 0.254: 135.89,78.11 134.62,79.38 134.62,80.64 B3.EE | 135.89,78.11 149.22,64.77 149.22,57.78 149.86,57.15 D15.A | 135.89,78.11 135.89,92.08 134.62,93.34 B2.EE
DATA1CT
  Top 0.254: IC3.8 140.34,52.7 146.69,46.35 D16.C
  Bottom 0.254: B2.Z 127,95.89 125.73,94.61 125.73,85.72 127,84.45 B3.Z 127,83.19 128.27,81.92 128.27,74.93 137.79,65.41 137.79,55.24 139.06,53.98 IC3.8
DATA2+
  Top 0.254: R6.1 117.47,55.88 118.75,55.88 D11.A
  Bottom 0.254: B2.M 114.3,93.34 113.03,92.08 113.03,83.19 114.3,81.92 B3.M 114.3,80.64 115.57,79.38 115.57,57.78 116.84,56.52 R6.1
DATA2-
  Bottom 0.254: D12.A 121.28,56.52 118.11,59.69 118.11,81.92 116.84,83.19 B3.R 116.84,84.45 115.57,85.72 115.57,94.61 116.84,95.89 B2.R
DATA2CT
  Bottom 0.254: B2.K 111.76,93.34 110.49,92.08 110.49,83.19 111.76,81.92 B3.K 111.76,80.64 113.03,79.38 113.03,54.61 120.65,46.99 120.65,44.45 121.28,43.81 123.83,43.81 123.83,45.09 D13.C 124.46,46.99 130.18,52.7 130.18,53.98 131.44,55.24 IC3.6
DATA3+
  Top 0.254: R5.1 117.47,71.12 118.75,71.12 D8.A
  Bottom 0.254: B3.F 106.68,84.45 105.41,85.72 105.41,94.61 106.68,95.89 B2.F 106.68,97.16 106.68,97.79 117.47,97.79 118.11,97.16 118.11,93.34 120.65,90.81 120.65,73.66 119.38,72.39 D8.A
DATA3-  (via drill 0.61)
  Top 0.254: v121.92,78.11 88.27,78.11 81.28,85.09 62.87,85.09 61.59,83.82 A3.TT
  Bottom 0.254: A3.TT 60.96,84.45 59.69,85.72 59.69,94.61 60.96,95.89 A2.TT | v121.92,78.11 121.92,72.39 D9.A
DATA3CT  (via drill 0.61)
  Top 0.254: D10.C 125.09,60.96 130.81,60.96 IC3.4 | v125.73,73.03 123.19,75.56 88.27,75.56 82.55,81.28 64.14,81.28 A3.UU
  Bottom 0.254: A3.UU 63.5,81.92 62.23,83.19 62.23,92.08 63.5,93.34 A2.UU | v125.73,73.03 125.73,63.5 124.46,62.23 D10.C
DRV0  (via drill 0.61)
  Top 0.254: v50.16,11.43 79.38,11.43 80.64,12.7 82.55,12.7 IC4.6
  Bottom 0.254: v50.16,11.43 50.16,15.88 48.9,17.14 IC5.4
DRV1  (via drill 0.61)
  Top 0.254: v79.38,13.97 43.18,13.97 41.91,15.24 IC6.12
  Bottom 0.254: v79.38,13.97 82.55,10.79 82.55,10.16 IC4.7
DRV2
  Top 0.254: IC6.4 31.75,17.78 30.48,16.51 21.59,16.51 19.68,14.61 19.68,1.91 84.45,1.91 90.17,7.62 IC4.9
DRVOK  (via drill 0.61)
  Top 0.254: v54.61,35.56 58.42,31.75 62.23,31.75 69.85,24.13 100.33,24.13 102.87,21.59 106.68,21.59 110.49,17.78 IC1.19
  Bottom 0.254: v54.61,35.56 54.61,41.91 53.98,42.55 D26.C
FORWARD
  Top 0.254: D27.C 24.13,25.4 26.67,25.4 RN2.2
  Bottom 0.254: IC6.6 32.38,13.34 30.48,15.24 30.48,22.86 28.57,24.77 RN2.2
GND  (via drill 0.61)
  Top 0.508: C2.- C9.2 IC3.12 137.16,63.5 137.16,55.88 132.72,51.44 118.75,51.44 v114.3,55.88 107.31,48.9 71.12,48.9 v70.48,48.26 D31.C | IC1.8 105.41,22.86 107.95,25.4 IC1.22 113.03,25.4 113.67,26.04 115.57,26.04 117.47,27.94 D36.A 123.83,28.57 123.83,29.84 D37.A | D1.A 121.92,19.05 123.19,17.78 C1.2 125.09,17.78 127,19.68 R2.2 | C8.2 IC2.12 | v104.14,90.81 106.68,93.34 B2.E | Q1.1 24.77,38.1 20.95,41.91 C3.+ 15.88,41.91 12.7,38.73 8.26,38.73 GND.1 | v17.78,90.81 20.32,93.34 A2.E | D42.C 70.48,28.57 70.48,29.84 D43.C | D43.C 81.92,30.48 84.45,27.94 C6.2 | D43.C 70.48,31.11 70.48,32.38 D44.C 70.48,33.66 70.48,34.92 D45.C | D41.C 70.48,38.73 70.48,40.01 D40.C 70.48,41.27 70.48,42.55 D39.C | IC6.8 28.57,3.17 27.3,3.17 D46.C 22.23,8.26 22.23,9.53 D47.C 22.23,10.79 22.23,12.06 D48.C 22.23,13.34 22.23,14.61 D49.C | IC5.1 52.07,25.4 54.61,22.86 IC5.15 | IC5.13 54.61,17.78 53.34,19.05 50.8,19.05 49.53,20.32 IC5.3 44.45,20.32 41.91,17.78 IC6.13 36.83,17.78 36.2,18.41 | 36.2,18.41 34.29,20.32 IC6.3 | 36.2,18.41 IC6.15
  Bottom 0.508: J1.14 162.56,13.97 156.84,13.97 156.84,58.42 152.4,62.87 C2.- | D36.A 123.83,27.3 123.83,26.67 122.56,25.4 C7.2 121.92,24.77 121.92,21.59 D1.A | D37.A 123.83,31.11 123.83,32.38 D32.A 123.83,33.66 123.83,34.92 D33.A 123.83,36.2 123.83,37.47 D35.A 123.83,38.73 123.83,40.01 D34.A | 109.22,71.12 109.22,66.04 107.31,64.14 IC2.12 | 109.22,71.12 109.22,78.11 106.68,80.64 B3.E | v104.14,90.81 99.69,86.36 99.69,80.64 109.22,71.12 | IC3.12 140.34,62.87 142.24,60.96 142.24,42.55 J1.11 142.24,41.91 142.88,41.27 142.88,22.86 138.43,18.41 138.43,16.51 136.53,16.51 J1.13 133.99,15.88 133.99,7.62 125.73,7.62 124.46,8.89 124.46,10.16 122.56,12.06 122.56,15.24 124.46,17.14 C1.2 | v114.3,55.88 114.3,62.87 C8.2 | 13.34,73.66 9.53,69.85 9.53,40.01 8.26,38.73 GND.1 | 13.34,73.66 20.32,80.64 A3.E | v17.78,90.81 13.34,86.36 13.34,73.66 | IC4.8 84.45,8.26 86.36,10.16 86.36,12.7 84.45,14.61 IC4.5 84.45,15.88 86.36,17.78 86.36,26.04 85.09,27.3 C6.2 | D41.C 70.48,37.47 70.48,36.2 D45.C | D39.C 70.48,43.81 70.48,45.09 D38.C 70.48,46.35 v70.48,48.26 | D31.C 40.01,47.62 38.1,45.72 38.1,32.38 34.29,28.57 C4.2 34.29,27.3 34.29,26.67 33.66,26.04 IC6.1 33.66,24.77 35.56,22.86 35.56,17.78 | C5.2 49.53,27.3 49.53,26.67 48.9,26.04 IC5.1 48.9,24.77 50.8,22.86 50.8,17.78 | 50.8,17.78 48.9,19.68 IC5.3 | 50.8,17.78 51.44,17.14 51.44,10.79 48.9,8.26 IC5.8 | 35.56,17.78 35.56,10.16 33.66,8.26 IC6.8 | 35.56,17.78 33.66,19.68 IC6.3 | Q1.1 25.4,37.47 25.4,30.48 20.32,25.4 20.32,17.78 22.23,15.88 D49.C
HALT
  Top 0.254: D30.C 24.13,17.78 26.67,17.78 RN2.5
  Bottom 0.254: IC5.10 55.24,9.53 53.98,8.26 53.98,6.99 52.7,5.71 29.84,5.71 29.84,15.88 28.57,17.14 RN2.5
J
  Bottom 0.254: A6.M 27.94,56.52 26.67,57.78 26.67,66.67 27.94,67.94 A5.M
MARK+  (via drill 0.61)
  Top 0.254: R4.1 87,55.88 88.27,55.88 D5.A | v70.48,77.47 67.94,80.01 50.16,80.01 48.9,81.28 A3.EE
  Bottom 0.254: A3.EE 48.26,81.92 46.99,83.19 46.99,92.08 48.26,93.34 A2.EE | v70.48,77.47 70.48,72.39 86.36,56.52 R4.1
MARK-  (via drill 0.61)
  Top 0.254: v87.63,77.47 82.55,82.55 47.62,82.55 46.35,83.82 A3.DD
  Bottom 0.254: v87.63,77.47 90.17,74.93 90.17,58.42 91.44,57.15 D6.A | A2.DD 45.72,95.89 44.45,94.61 44.45,85.72 45.72,84.45 A3.DD
MARKCT
  Bottom 0.254: A2.PP 58.42,93.34 57.15,92.08 57.15,83.19 58.42,81.92 A3.PP 59.05,81.28 60.96,79.38 99.69,79.38 99.69,70.48 100.97,69.22 100.97,67.94 100.33,67.31 96.52,67.31 96.52,49.53 | 96.52,49.53 97.16,50.16 97.16,53.98 98.42,55.24 IC2.6 | 96.52,49.53 93.98,46.99 D7.C
MIN  (via drill 0.61)
  Top 0.254: v53.98,16.51 31.75,16.51 31.11,15.88 29.84,15.88 29.21,15.24 RN2.6
  Bottom 0.254: v53.98,16.51 53.98,14.61 55.24,13.34 IC5.11 56.52,12.06 57.78,10.79 57.78,8.26 59.69,6.35 62.23,6.35 69.22,13.34 69.22,78.74 88.9,78.74 98.42,69.22 IC2.1
MOUT
  Bottom 0.254: IC1.17 111.12,12.06 105.41,6.35 86.36,6.35 86.36,8.89 87.63,10.16 87.63,43.81 86.36,45.09 R4.2
N$1
  Top 0.254: X1.1 99.69,15.24 102.23,17.78 102.87,17.78 IC1.10
N$2
  Top 0.254: X1.2 99.69,20.32 102.87,20.32 IC1.9
N$3
  Top 0.254: D18.C 72.39,7.62 74.93,7.62 RN4.2 77.47,7.62 78.74,6.35 86.36,6.35 90.17,10.16 IC4.10
N$4
  Top 0.254: D19.C 72.39,10.16 74.93,10.16 RN4.3 77.47,10.16 79.38,10.16 80.64,11.43 88.9,11.43 90.17,12.7 IC4.11
N$5
  Top 0.254: D20.C 72.39,12.7 74.93,12.7 RN4.4 77.47,12.7 79.38,12.7 80.64,13.97 88.9,13.97 90.17,15.24 IC4.12
N$7
  Top 0.254: D2.C 89.53,60.33 90.81,60.33 D3.C 92.08,60.33 93.34,59.05 97.16,59.05 97.79,58.42 IC2.5
  Bottom 0.254: D4.A 93.98,69.85 91.44,67.31 91.44,62.23 D3.C
N$8
  Top 0.254: D21.C 72.39,15.24 74.93,15.24 RN4.5 77.47,15.24 78.74,16.51 88.9,16.51 90.17,17.78 IC4.13
N$9
  Top 0.254: D22.C 72.39,25.4 74.93,25.4 RN4.9 77.47,25.4 82.55,25.4 IC4.1
N$10
  Top 0.254: D23.C 72.39,22.86 74.93,22.86 RN4.8 77.47,22.86 82.55,22.86 IC4.2
N$11
  Top 0.254: D5.C 89.53,45.09 90.81,45.09 D6.C | D7.A 94.61,55.24 96.52,53.34 97.79,53.34 IC2.7
  Bottom 0.254: D6.C 91.44,46.99 93.98,49.53 93.98,54.61 D7.A
N$12
  Top 0.254: D8.C 120.02,60.33 121.28,60.33 D9.C
  Bottom 0.254: IC3.5 130.81,58.42 121.92,58.42 121.92,59.69 D9.C 121.92,62.23 121.92,67.31 124.46,69.85 D10.A
N$13
  Top 0.254: D11.C 120.02,45.09 121.28,45.09 D12.C | D13.A 125.09,55.24 127,53.34 130.81,53.34 IC3.7
  Bottom 0.254: D12.C 121.92,46.99 124.46,49.53 124.46,54.61 D13.A
N$14
  Top 0.254: D15.C 150.5,45.09 151.76,45.09 D14.C | IC3.9 140.97,55.88 146.69,55.88 D16.A
  Bottom 0.254: D15.C 149.86,46.99 147.32,49.53 147.32,54.61 D16.A
N$15
  Top 0.254: D24.C 72.39,20.32 74.93,20.32 RN4.7 77.47,20.32 82.55,20.32 IC4.3
N$16
  Top 0.254: D25.C 72.39,17.78 74.93,17.78 RN4.6 77.47,17.78 82.55,17.78 IC4.4
N$17
  Top 0.254: R12.2 102.23,40.64 102.87,40.64 IC1.1
N$18
  Bottom 0.254: Q1.3 26.04,43.18 29.21,43.18 29.21,42.55 33.02,38.73 R10.1
N$19
  Top 0.254: Q1.2 28.57,40.64 29.84,41.91 38.73,41.91 40.01,43.18 R11.2 41.27,43.18 41.91,43.18 D26.A
REVERSE  (via drill 0.61)
  Top 0.254: D28.C 24.13,22.86 26.67,22.86 RN2.3 29.21,22.86 30.48,21.59 36.2,21.59 v36.83,20.95
  Bottom 0.254: v36.83,20.95 36.83,13.97 40.01,10.79 IC6.10
SELECT
  Bottom 0.254: R10.2 35.56,38.73 36.83,40.01 36.83,56.52 35.56,57.78 A6.V 35.56,59.05 36.83,60.33 36.83,69.22 35.56,70.48 A5.V
SHIELD1
  Top 0.508: 35.56,84.45 36.83,85.72 49.53,85.72 50.8,84.45 A3.JJ | 35.56,84.45 A3.V 35.56,84.45 | 36.83,98.42 35.56,97.16 A2.V | 36.83,98.42 49.53,98.42 50.8,97.16 A2.JJ | 35.56,84.45 30.48,89.53 17.14,89.53 13.34,93.34 13.34,98.42 36.83,98.42
SHIELD2
  Top 0.508: 65.41,93.34 64.14,92.08 63.5,92.08 55.88,84.45 A3.NN | 65.41,93.34 65.41,98.42 57.15,98.42 55.88,97.16 A2.NN | 116.84,89.53 119.38,92.08 125.73,92.08 127,93.34 B2.Y | 116.84,89.53 111.76,84.45 B3.L | 99.69,90.17 99.69,89.53 | 99.69,90.17 99.69,97.16 100.97,98.42 110.49,98.42 111.76,97.16 B2.L | 99.69,89.53 116.84,89.53 | 99.69,89.53 99.69,80.64 100.97,79.38 125.73,79.38 127,80.64 B3.Y | 65.41,93.34 68.58,90.17 99.69,90.17
SKEW
  Bottom 0.254: A3.F 20.32,84.45 19.05,85.72 19.05,94.61 20.32,95.89 A2.F
STOP  (via drill 0.61)
  Top 0.254: D29.C 24.13,20.32 26.67,20.32 RN2.4 | v26.04,11.43 29.21,11.43 31.75,13.97 41.91,13.97 42.55,13.34 46.35,13.34 46.99,12.7 IC5.6
  Bottom 0.254: v26.04,11.43 26.04,18.41 27.3,19.68 RN2.4
TIMING+  (via drill 0.61)
  Top 0.254: D2.A 88.27,71.12 87,71.12 R3.1 85.72,71.12 81.28,75.56 v31.75,75.56
  Bottom 0.254: A2.K 25.4,93.34 26.67,92.08 26.67,83.19 25.4,81.92 A3.K 26.04,81.28 v31.75,75.56
TIMING-
  Top 0.254: D3.A 90.81,71.75 86.36,76.2 36.2,76.2 31.75,80.64 31.75,83.19 30.48,83.19 A3.R
  Bottom 0.254: A2.R 30.48,95.89 31.75,94.61 31.75,85.72 30.48,84.45 A3.R
TIMINGCT
  Top 0.254: IC2.4 97.79,60.96 94.61,60.96 D4.C 93.34,61.59 88.9,66.04 31.11,66.04 29.21,67.94 29.21,80.64 27.94,80.64 A3.M
  Bottom 0.254: A3.M 27.94,81.92 29.21,83.19 29.21,92.08 27.94,93.34 A2.M
TIN
  Top 0.254: IC1.6 104.78,28.57 109.22,33.02 109.22,43.18 128.27,43.18 RN3.8
  Bottom 0.254: IC2.2 98.42,65.41 97.16,64.14 97.16,57.78 97.79,57.15 104.78,57.15 104.78,42.55 106.05,41.27 106.05,29.84 104.78,28.57 IC1.6
TOUT  (via drill 0.61)
  Top 0.254: v95.89,19.05 106.68,19.05 110.49,15.24 IC1.18
  Bottom 0.254: v95.89,19.05 93.34,21.59 93.34,41.27 90.17,44.45 90.17,57.15 87,60.33 87,60.96 R3.2
V+  (via drill 0.61)
  Top 0.508: v106.05,70.48 111.76,70.48 113.67,68.58 C8.1 114.94,68.58 129.54,68.58 131.44,70.48 137.16,70.48 | 137.16,70.48 137.16,71.12 139.06,71.12 R8.2 140.34,71.12 144.15,71.12 146.69,68.58 C9.1 | 137.16,70.48 137.16,66.67 133.99,63.5 133.35,63.5 IC3.3
  Bottom 0.508: v106.05,70.48 99.69,64.14 IC2.3
VCC  (via drill 0.61)
  Top 0.508: IC1.7 102.87,25.4 92.71,25.4 IC4.16 | v111.76,76.83 143.51,76.83 149.22,71.12 R8.1 | 36.83,29.84 31.11,29.84 29.21,27.94 RN2.1 26.67,27.94 10.16,27.94 8.26,29.84 +5V.1 | 36.83,29.84 38.73,27.94 C4.1 | 36.83,29.84 52.07,29.84 53.98,27.94 C5.1 | IC1.20 111.12,20.95 111.12,22.23 IC1.21 | 116.84,22.86 113.03,22.86 IC1.21 | 116.84,22.86 125.73,22.86 128.27,25.4 RN3.1 | 116.84,22.86 116.84,24.77 C7.1 | v52.7,7.62 55.24,5.08 74.93,5.08 RN4.1 | v107.95,22.86 110.49,22.86 IC1.21
  Bottom 0.508: R8.1 149.86,70.48 152.4,67.94 152.4,66.67 C2.+ | IC4.16 90.81,26.04 90.17,26.67 90.17,27.3 C6.1 90.17,28.57 90.17,38.73 91.44,40.01 R12.1 | v111.76,76.83 110.49,75.56 110.49,46.99 107.31,43.81 107.31,28.57 104.78,26.04 IC1.7 105.41,25.4 v107.95,22.86 | C5.1 54.61,27.3 54.61,26.67 55.24,26.04 IC5.16 55.24,24.77 52.7,22.23 v52.7,7.62 | IC6.16 40.01,26.04 39.37,26.67 39.37,27.3 C4.1 | 116.84,20.32 116.84,24.77 C7.1 | 116.84,20.32 116.84,5.08 77.47,5.08 RN4.1 | 116.84,20.32 118.75,20.32 R1.2
VDD  (via drill 0.61)
  Top 0.508: R1.1 120.02,10.16 121.28,10.16 D1.C 122.56,10.79 123.19,10.79 124.46,12.06 C1.1 125.09,12.7 130.81,12.7 v138.43,20.32 | v132.72,28.57 134.62,26.67 v139.06,26.67
  Bottom 0.508: v132.72,28.57 133.99,28.57 J1.4 | v139.06,26.67 138.43,26.04 v138.43,20.32
VSS
  Bottom 0.508: R2.1 127,10.79 130.18,13.97 130.18,22.86 133.35,26.04 133.99,26.04 J1.3 136.53,26.04 137.79,27.3 137.79,32.38 136.53,33.66 J1.6
WE
  Top 0.254: D17.A 41.91,45.72 41.27,45.72 R9.2 40.01,45.72 38.1,45.72 | 38.1,45.72 34.29,45.72 31.75,48.26 D31.A | 38.1,45.72 38.1,55.24 A6.W
  Bottom 0.254: A5.W 38.1,67.94 37.47,67.31 37.47,59.69 36.83,59.05 36.83,57.78 38.1,56.52 A6.W

### Text on the board
Top: VRS | DECtape Drive Emulation
Bottom: DECtape Drive Emulation | VRS